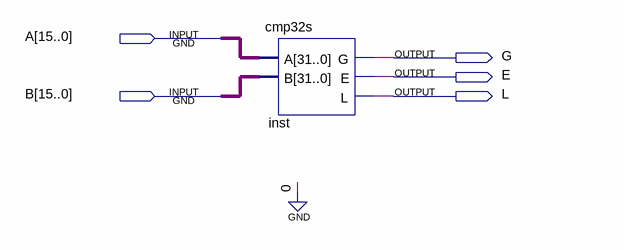
[diagram p0: schematic sheet]
// Quartus schematic cmp16s.bdf as structural Verilog: 1 symbols, 5 pins
module cmp16s (
  input  [15:0] A,
  input  [15:0] B,
  output G,
  output E,
  output L
);

  cmp32s inst (.A({A, {16{1'b0}}}), .B({B, {16{1'b0}}}), .G(G), .E(E), .L(L));
endmodule
